# Altium schematic sheet [05] - Motor and LEDs.SchDoc
size A4
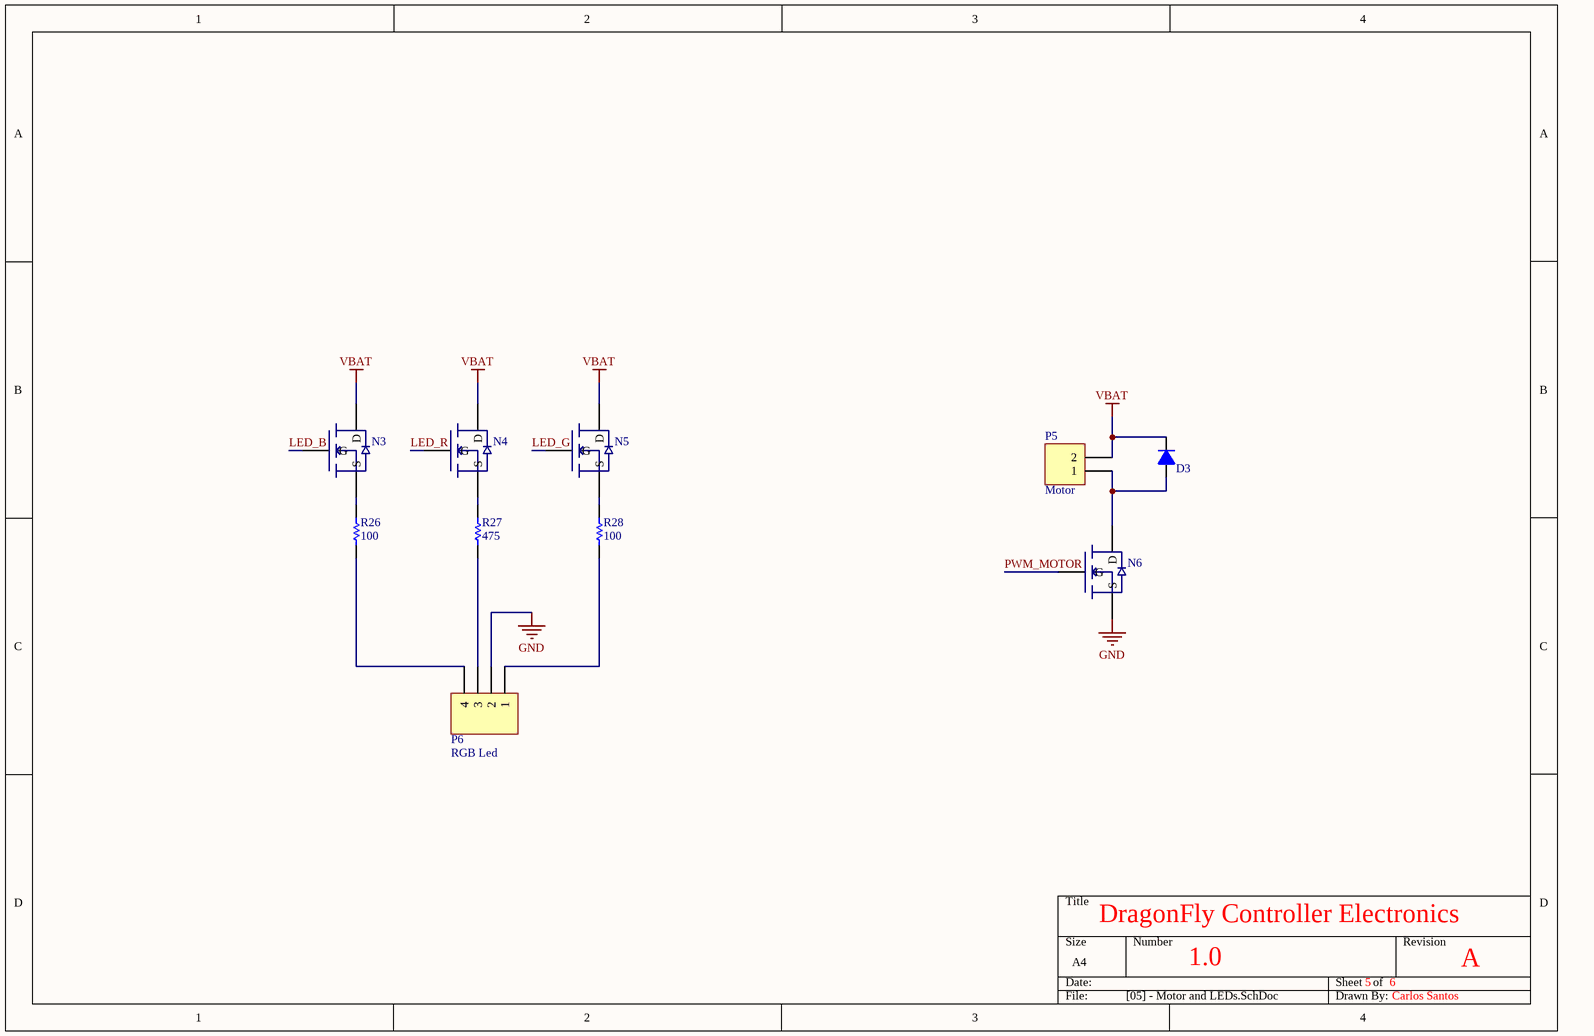
[diagram p0: [05] - Motor and LEDs.SchDoc]

## Parts
D3  Diode  [0402 - Led]  (value not drawn)
N3  N-MOSFET  [DFN1006-3]  (value not drawn)
N4  N-MOSFET  [DFN1006-3]  (value not drawn)
N5  N-MOSFET  [DFN1006-3]  (value not drawn)
N6  N-MOSFET  [DFN1006-3]  (value not drawn)
P5  Motor  [HDR1X2]
P6  RGB Led  [HDR1X4]
R26  value 100  [0402 - Resistor]  (hidden comment: Resistor)
R27  value 475  [0402 - Resistor]  (hidden comment: Resistor)
R28  value 100  [0402 - Resistor]  (hidden comment: Resistor)

## Nets
GND: N6.1(S) P6.2
VBAT: D3.2(K) N3.3(D) N4.3(D) N5.3(D) P5.2
LED_B: N3.2(G)
LED_G: N5.2(G)
LED_R: N4.2(G)
PWM_MOTOR: N6.2(G)
NetD3_1: D3.1(A) N6.3(D) P5.1
NetN3_1: N3.1(S) R26.2
NetN4_1: N4.1(S) R27.2
NetN5_1: N5.1(S) R28.2
NetP6_1: P6.1 R28.1
NetP6_3: P6.3 R27.1
NetP6_4: P6.4 R26.1

## Notes on the sheet
- DragonFly Controller Electronics
- 1.0
- 5
- 6
- A
- Carlos Santos

## Library data of the parts
P5 = Header 2: Header, 2-Pin; LatestRevisionDate: 17-Jul-2002; LatestRevisionNote: Re-released for DXP Platform.; Publisher: Altium Limited
P6 = Header 4: Header, 4-Pin; LatestRevisionDate: 17-Jul-2002; LatestRevisionNote: Re-released for DXP Platform.; Publisher: Altium Limited; DigiKey Part #: 1830-1015-ND
D3 = Diode: DigiKey Part #: *